# Altium schematic sheet E17-04-HVD.SchDoc
size A; DocumentNumber: 13; SheetNumber: 13; SheetTotal: 18
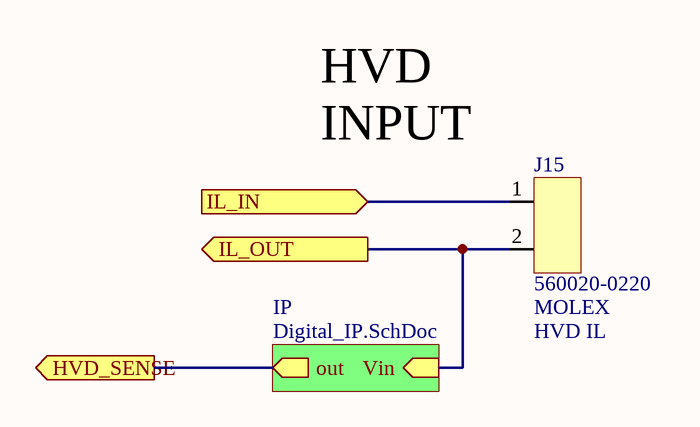
[diagram p0: E17-04-HVD.SchDoc]

## Parts
J15  HVD IL  MANUFACTURER: MOLEX  [MOLEX_DURACLIK_2 NAT VERT]

## Sub-sheets
IP = Digital_IP.SchDoc: Vin (in), out (out)

## Ports
HVD_SENSE (out), IL_IN (in), IL_OUT (out)

## Nets
HVD_SENSE: port HVD_SENSE, sheet IP/out
IL_IN: J15.1 ; port IL_IN
IL_OUT: J15.2 ; port IL_OUT, sheet IP/Vin

## Notes on the sheet
- (near J15) HVD
  INPUT

## Library data of the parts
J15 = 560020-0220: MOLEX DURACLIK 2-PIN VERT NAT; POSITIONS: 2; UL: 94V-0; VOLTAGE: 125; CURRENT: 3; PLATING: Tin (Sn); Digikey_PN: Not in production; COLOR: NAT; SERIES: Duraclik; ORIENTATOIN: VERT; MPN: 560020-0220